# Altium schematic sheet web_sch.SchDoc
size A4
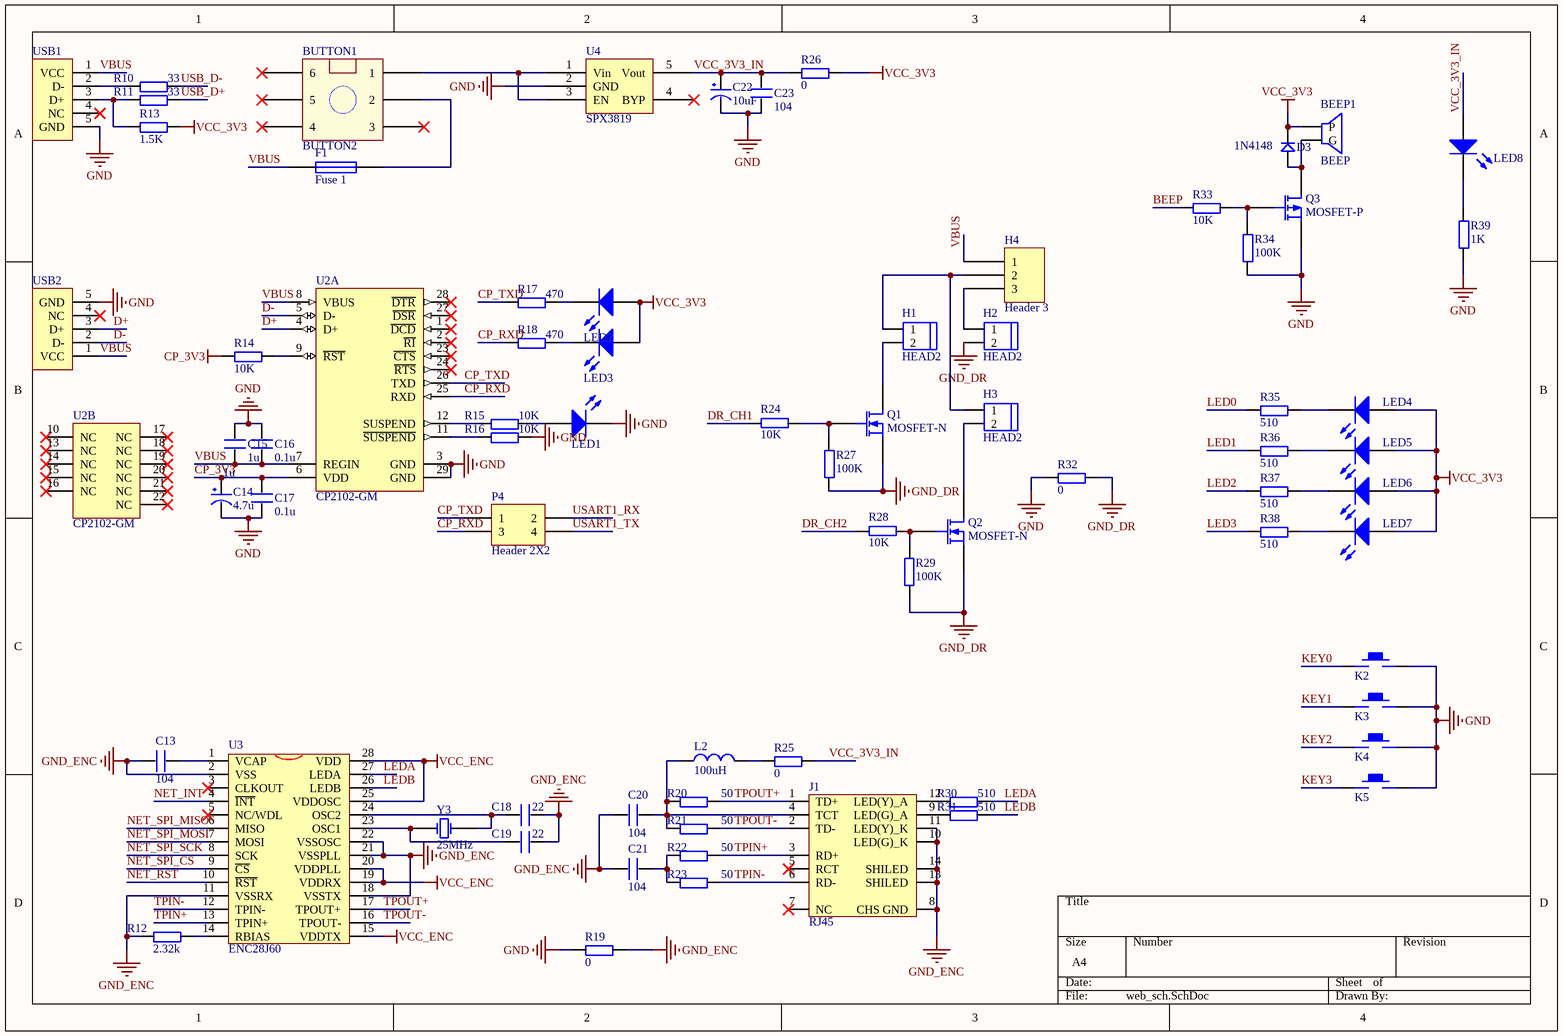
[diagram p0: web_sch.SchDoc]

## Parts
BEEP1  BEEP  [BELL-5]
BUTTON1  BUTTON2  [BTN8.5*8.5]
C13  104  [0603P]
C14  4.7u  [TAJ_A]
C15  1u  [0603P]
C16  0.1u  [0603P]
C17  0.1u  [0603P]
C18  22  [0603P]
C19  22  [0603P]
C20  104  [0603P]
C21  104  [0603P]
C22  10uF  [TAJ_A]
C23  104  [0603P]
D3  1N4148  [DIODE_SOP]
F1  Fuse 1  [0603P]
H1  HEAD2  [HEAD2L-0.8]
H2  HEAD2  [HEAD2L-0.8]
H3  HEAD2  [HEAD2L-0.8]
H4  Header 3  [HEAD3]
J1  RJ45  [RJ8-1]
K2  KEY  [KEY2]  (value not drawn)
K3  KEY  [KEY2]  (value not drawn)
K4  KEY  [KEY2]  (value not drawn)
K5  KEY  [KEY2]  (value not drawn)
L2  100uH  [0603P]
LED1  LED  [LED_0603]  (value not drawn)
LED2  LED  [LED_0603]  (value not drawn)
LED3  LED  [LED_0603]  (value not drawn)
LED4  LED  [LED_0603]  (value not drawn)
LED5  LED  [LED_0603]  (value not drawn)
LED6  LED  [LED_0603]  (value not drawn)
LED7  LED  [LED_0603]  (value not drawn)
LED8  LED  [LED_0603]  (value not drawn)
P4  Header 2X2  [HDR2X2]
Q1  MOSFET-N  [SOT-23]
Q2  MOSFET-N  [SOT-23]
Q3  MOSFET-P  [SOT-23]
R10  33  [0603P]
R11  33  [0603P]
R12  2.32k  [0603P]
R13  1.5K  [0603P]
R14  10K  [0603P]
R15  10K  [0603P]
R16  10K  [0603P]
R17  470  [0603P]
R18  470  [0603P]
R19  0  [0603P]
R20  50  [0603P]
R21  50  [0603P]
R22  50  [0603P]
R23  50  [0603P]
R24  10K  [0603P]
R25  0  [0603P]
R26  0  [0603P]
R27  100K  [0603P]
R28  10K  [0603P]
R29  100K  [0603P]
R30  510  [0603P]
R31  510  [0603P]
R32  0  [0603P]
R33  10K  [0603P]
R34  100K  [0603P]
R35  510  [0603P]
R36  510  [0603P]
R37  510  [0603P]
R38  510  [0603P]
R39  1K  [0603P]
U2  CP2102-GM  [SLAB-QFN-28-3125x3125TP_N]  (parts A,B of 2)
U3  ENC28J60  [SSOP28]
U4  SPX3819  [SOT23-5]
USB1  (no value)  [USB-MICRO-5P-2]
USB2  (no value)  [USB-MICRO-5P-2]
Y3  25MHz  [XTAL_US]

## Nets
CP_3V3: C14.1(VCC) C17.2 R14.1 U2.6(VDD)
GND: C14.2(GND) C15.2 C16.2 C17.1 C22.2(GND) C23.1 K2.2 K3.2 K4.2 K5.2 LED1.2(K) Q3.2(S) R16.2 R19.1 R32.1 R34.1 R39.1 U2.3(GND) U2.29(GND) U4.2(GND) USB1.5(GND) USB2.5(GND)
GND_DR: H2.2 Q1.2(S) Q2.2(S) R27.1 R29.2 R32.2
GND_ENC: C13.1 C18.2 C19.2 C20.1 C21.1 J1.8(CHS_GND) J1.10(LED(G)_K) J1.11(LED(Y)_K) J1.13(SHILED) J1.14(SHILED) R12.1 R19.2 U3.2(VSS) U3.11(VSSRX) U3.18(VSSTX) U3.21(VSSPLL) U3.22(VSSOSC)
VCC_3V3: BEEP1.1(P) D3.2 LED2.1(A) LED3.1(A) LED4.1(A) LED5.1(A) LED6.1(A) LED7.1(A) R13.2 R26.2
VCC_ENC: U3.15(VDDTX) U3.19(VDDRX) U3.20(VDDPLL) U3.25(VDDOSC) U3.28(VDD)
BEEP: R33.1
CP_RXD: P4.3 R18.1 U2.25(RXD)
CP_TXD: P4.1 R17.1 U2.26(TXD)
D+: U2.4(D+) USB2.3(D+)
D-: U2.5(D-) USB2.2(D-)
DR_CH1: R24.2
DR_CH2: R28.2
KEY0: K2.1
KEY1: K3.1
KEY2: K4.1
KEY3: K5.1
LED0: R35.1
LED1: R36.1
LED2: R37.1
LED3: R38.1
LEDA: R30.2 U3.27(LEDA)
LEDB: R31.2 U3.26(LEDB)
NET_INT: U3.4(~{INT})
NET_RST: U3.10(~{RST})
NET_SPI_CS: U3.9(~{CS})
NET_SPI_MISO: U3.6(MISO)
NET_SPI_MOSI: U3.7(MOSI)
NET_SPI_SCK: U3.8(SCK)
TPIN+: J1.3(RD+) R22.2 U3.13(TPIN+)
TPIN-: J1.6(RD-) R23.2 U3.12(TPIN-)
TPOUT+: J1.1(TD+) R20.2 U3.17(TPOUT+)
TPOUT-: J1.2(TD-) R21.2 U3.16(TPOUT-)
USART1_RX: P4.2
USART1_TX: P4.4
USB_D+: R11.2
USB_D-: R10.2
VBUS: C15.1 C16.1 F1.1 H4.1 U2.7(REGIN) U2.8(VBUS) USB1.1(VCC) USB2.1(VCC)
VCC_3V3_IN: C22.1(VCC) C23.2 LED8.1(A) R25.2 R26.1 U4.5(Vout)
NetBEEP1_2: BEEP1.2(G) D3.1 Q3.3(D)
NetBUTTON1_1: BUTTON1.1 U4.1(Vin) U4.3(EN)
NetBUTTON1_2: BUTTON1.2 F1.2
NetC13_2: C13.2 U3.1(VCAP)
NetC18_1: C18.1 U3.24(OSC2) Y3.2(OSC2)
NetC19_1: C19.1 U3.23(OSC1) Y3.1(OSC1)
NetC20_2: C20.2 J1.4(TCT) L2.1 R20.1 R21.1
NetC21_2: C21.2 R22.1 R23.1
NetH1_1: H1.1 H3.1 H4.2
NetH1_2: H1.2 Q1.3(D)
NetH2_1: H2.1 H4.3
NetH3_2: H3.2 Q2.3(D)
NetJ1_9: J1.9(LED(G)_A) R31.1
NetJ1_12: J1.12(LED(Y)_A) R30.1
NetL2_2: L2.2 R25.1
NetLED1_1: LED1.1(A) R15.2
NetLED2_2: LED2.2(K) R17.2
NetLED3_2: LED3.2(K) R18.2
NetLED4_2: LED4.2(K) R35.2
NetLED5_2: LED5.2(K) R36.2
NetLED6_2: LED6.2(K) R37.2
NetLED7_2: LED7.2(K) R38.2
NetLED8_2: LED8.2(K) R39.2
NetQ1_1: Q1.1(G) R24.1 R27.2
NetQ2_1: Q2.1(G) R28.1 R29.1
NetQ3_1: Q3.1(G) R33.2 R34.2
NetR10_1: R10.1 USB1.2(D-)
NetR11_1: R11.1 R13.1 USB1.3(D+)
NetR12_2: R12.2 U3.14(RBIAS)
NetR14_2: R14.2 U2.9(~{RST})
NetR15_1: R15.1 U2.12(SUSPEND)
NetR16_1: R16.1 U2.11(~{SUSPEND})

Not connected (* = marked no-connect by the designer): BUTTON1 3* 4* 5* 6*; J1 5(RCT)* 7(NC)*; U2 1(~{DCD})* 2(~{RI})* 10(NC)* 13(NC)* 14(NC)* 15(NC)* 16(NC)* 17(NC)* 18(NC)* 19(NC)* 20(NC)* 21(NC)* 22(NC)* 23(~{CTS})* 24(~{RTS})* 27(~{DSR})* 28(~{DTR})*; U3 3(CLKOUT)* 5(NC/WDL)*; U4 4(BYP)*; USB1 4(NC)*; USB2 4(NC)*

## Library data of the parts
C13 C15-C21 C23 = C
C14 C22 = CAP
D3 = D
F1 = Fuse 1: Fuse; Published: 8-Jun-2000; LatestRevisionDate: 17-Jul-2002; LatestRevisionNote: Re-released for DXP Platform.; PackageReference: PIN-W2/E2.8; Publisher: Altium Limited; PackageDescription: Thru-Hole; 2 Leads
J1 = HR911105
L2 = Inductor: Value: 100uH
LED1-LED8 = LED: Typical RED, GREEN, YELLOW, AMBER GaAs LED; Published: 8-Jun-2000; LatestRevisionDate: 17-Jul-2002; LatestRevisionNote: Re-released for DXP Platform.; PackageDocument: Feb-2002; PackageReference: 3.2X1.6X1.1; Publisher: Altium Limited
P4 = Header 2X2: Header, 2-Pin, Dual row; LatestRevisionDate: 17-Jul-2002; LatestRevisionNote: Re-released for DXP Platform.; Publisher: Altium Limited
Q1 Q2 = MOSFET-N: N-Channel MOSFET; Published: 8-Jun-2000; LatestRevisionDate: 17-Jul-2002; LatestRevisionNote: Re-released for DXP Platform.; PackageVersion: 1995/1996; PackageReference: E3; Publisher: Altium Limited; PackageDescription: TO, Flat Index; 3 In-Line, Axial Leads; Body Dia. 4.6mm; Lead Dia. 0.5 mm (max)
Q3 = MOSFET-P: P-Channel MOSFET; Published: 8-Jun-2000; LatestRevisionDate: 17-Jul-2002; LatestRevisionNote: Re-released for DXP Platform.; PackageVersion: 1995/1996; PackageReference: E3; Publisher: Altium Limited; PackageDescription: TO, Flat Index; 3 In-Line, Axial Leads; Body Dia. 4.6mm; Lead Dia. 0.5 mm (max)
R10-R39 = R
U2 = CP2102-GM: Single-Chip USB to UART Bridge, 1024 Bytes EEPROM, -40 to 85 degC, 28-pin QFN, Tube; Manufacturer: Silicon Labs; Internal Oscillator: TRUE; Sub-Family: USB Bridges; DatasheetVersion: Rev. 1.5; PackageReference: QFN-28; PackageDescription: 28-Pin Quad-Flat No-Leads Package, Body 5 x 5 mm, Pitch 0.5 mm; Supplier 1: Digi-Key; Supplier Part Number 1: 336-1160-5-ND; Supplier 2: Farnell; Supplier Part Number 2: 9282130; Supplier 3: Newark; Supplier Part Number 3: 30K5635; Supplier 4: Mouser; Supplier Part Number 4: 634-CP2102-GM; EEPROM: 1024 Bytes; Mounting Technology: Surface Mount; Code_JEDEC: MO-220; Code_IPC: J-STD-020C; PartNumber: CP2102-GM; ComponentLink1Description: Manufacturer URL; ComponentLink1URL: http://www.silabs.com/; ComponentLink2Description: Datasheet; ComponentLink2URL: http://www.silabs.com/Support%20Documents/TechnicalDocs/CP2102-9.pdf; ComponentLink3Description: Package Specification; ComponentLink3URL: http://www.silabs.com/Support%20Documents/TechnicalDocs/C8051T61x.pdf
USB1 USB2 = USB5
Y3 = XTAL: Crystal Oscillator; Published: 8-Jun-2000; LatestRevisionDate: 17-Jul-2002; LatestRevisionNote: Re-released for DXP Platform.; Publisher: Altium Limited